# EAGLE schematic Relay-Board_Rack-PDU (EAGLE 9.2.1)

## Sheet 1 of 3
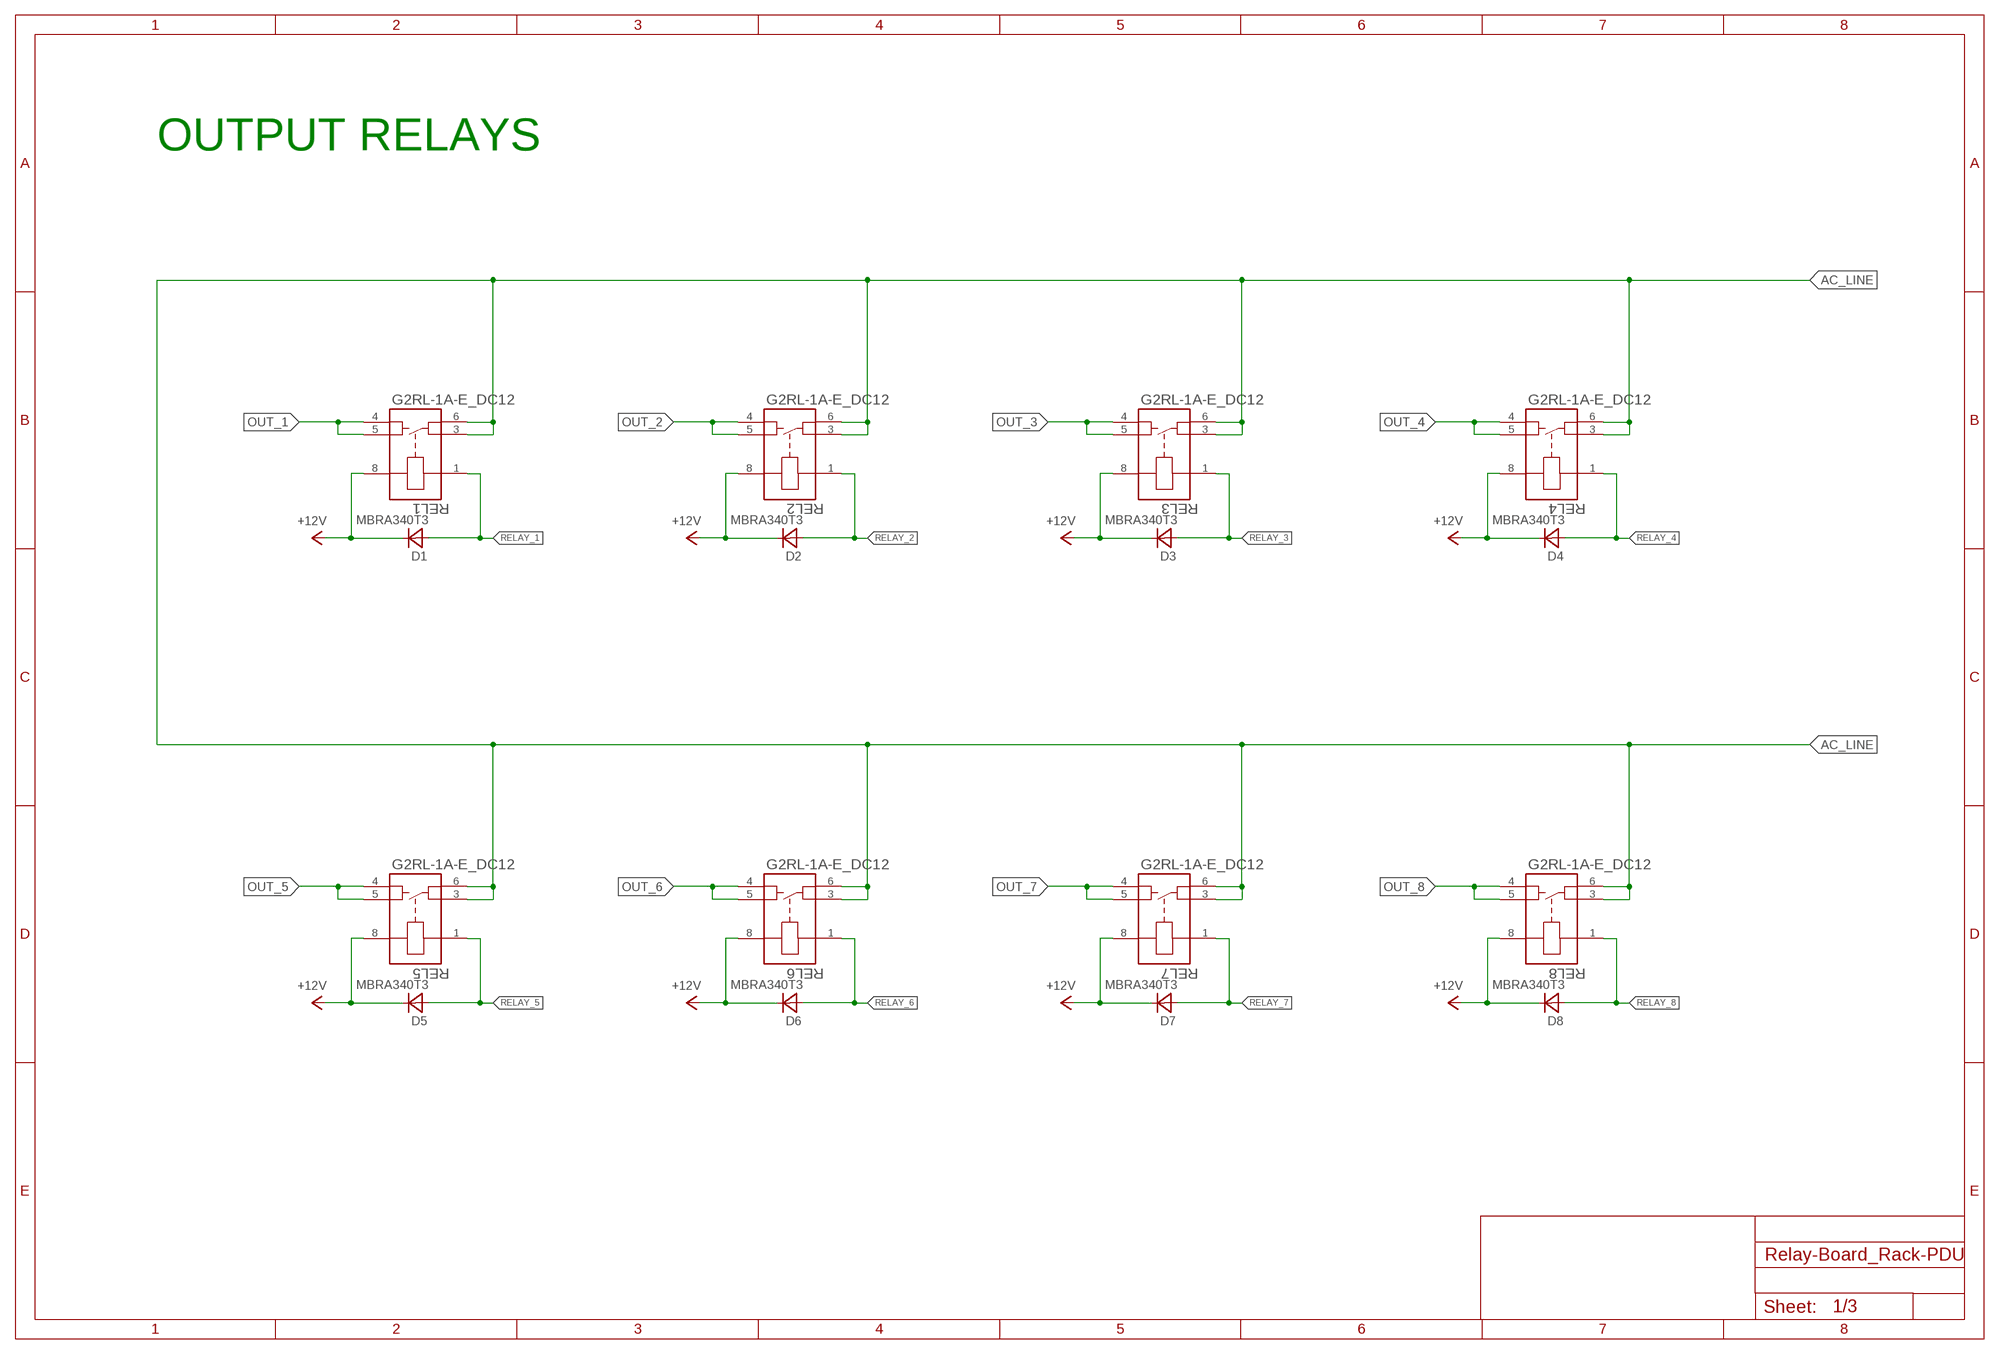
[diagram p0: schematic, sheet 1]

### Parts
D1  MBRA340T3  [SMA]
D2  MBRA340T3  [SMA]
D3  MBRA340T3  [SMA]
D4  MBRA340T3  [SMA]
D5  MBRA340T3  [SMA]
D6  MBRA340T3  [SMA]
D7  MBRA340T3  [SMA]
D8  MBRA340T3  [SMA]
REL1  G2RL-1A-E_DC12  [RELAY_G2RL-1A-E_DC5_OMR]
REL2  G2RL-1A-E_DC12  [RELAY_G2RL-1A-E_DC5_OMR]
REL3  G2RL-1A-E_DC12  [RELAY_G2RL-1A-E_DC5_OMR]
REL4  G2RL-1A-E_DC12  [RELAY_G2RL-1A-E_DC5_OMR]
REL5  G2RL-1A-E_DC12  [RELAY_G2RL-1A-E_DC5_OMR]
REL6  G2RL-1A-E_DC12  [RELAY_G2RL-1A-E_DC5_OMR]
REL7  G2RL-1A-E_DC12  [RELAY_G2RL-1A-E_DC5_OMR]
REL8  G2RL-1A-E_DC12  [RELAY_G2RL-1A-E_DC5_OMR]

### Nets
+12V: D1.C D2.C D3.C D4.C D5.C D6.C D7.C D8.C REL1.8 REL2.8 REL3.8 REL4.8 REL5.8 REL6.8 REL7.8 REL8.8
AC_LINE: REL1.3 REL1.6 REL2.3 REL2.6 REL3.3 REL3.6 REL4.3 REL4.6 REL5.3 REL5.6 REL6.3 REL6.6 REL7.3 REL7.6 REL8.3 REL8.6
OUT_1: REL1.4 REL1.5
OUT_2: REL2.4 REL2.5
OUT_3: REL3.4 REL3.5
OUT_4: REL4.4 REL4.5
OUT_5: REL5.4 REL5.5
OUT_6: REL6.4 REL6.5
OUT_7: REL7.4 REL7.5
OUT_8: REL8.4 REL8.5
RELAY_1: D1.A REL1.1
RELAY_2: D2.A REL2.1
RELAY_3: D3.A REL3.1
RELAY_4: D4.A REL4.1
RELAY_5: D5.A REL5.1
RELAY_6: D6.A REL6.1
RELAY_7: D7.A REL7.1
RELAY_8: D8.A REL8.1

### Notes on the sheet
- OUTPUT RELAYS

## Sheet 2 of 3
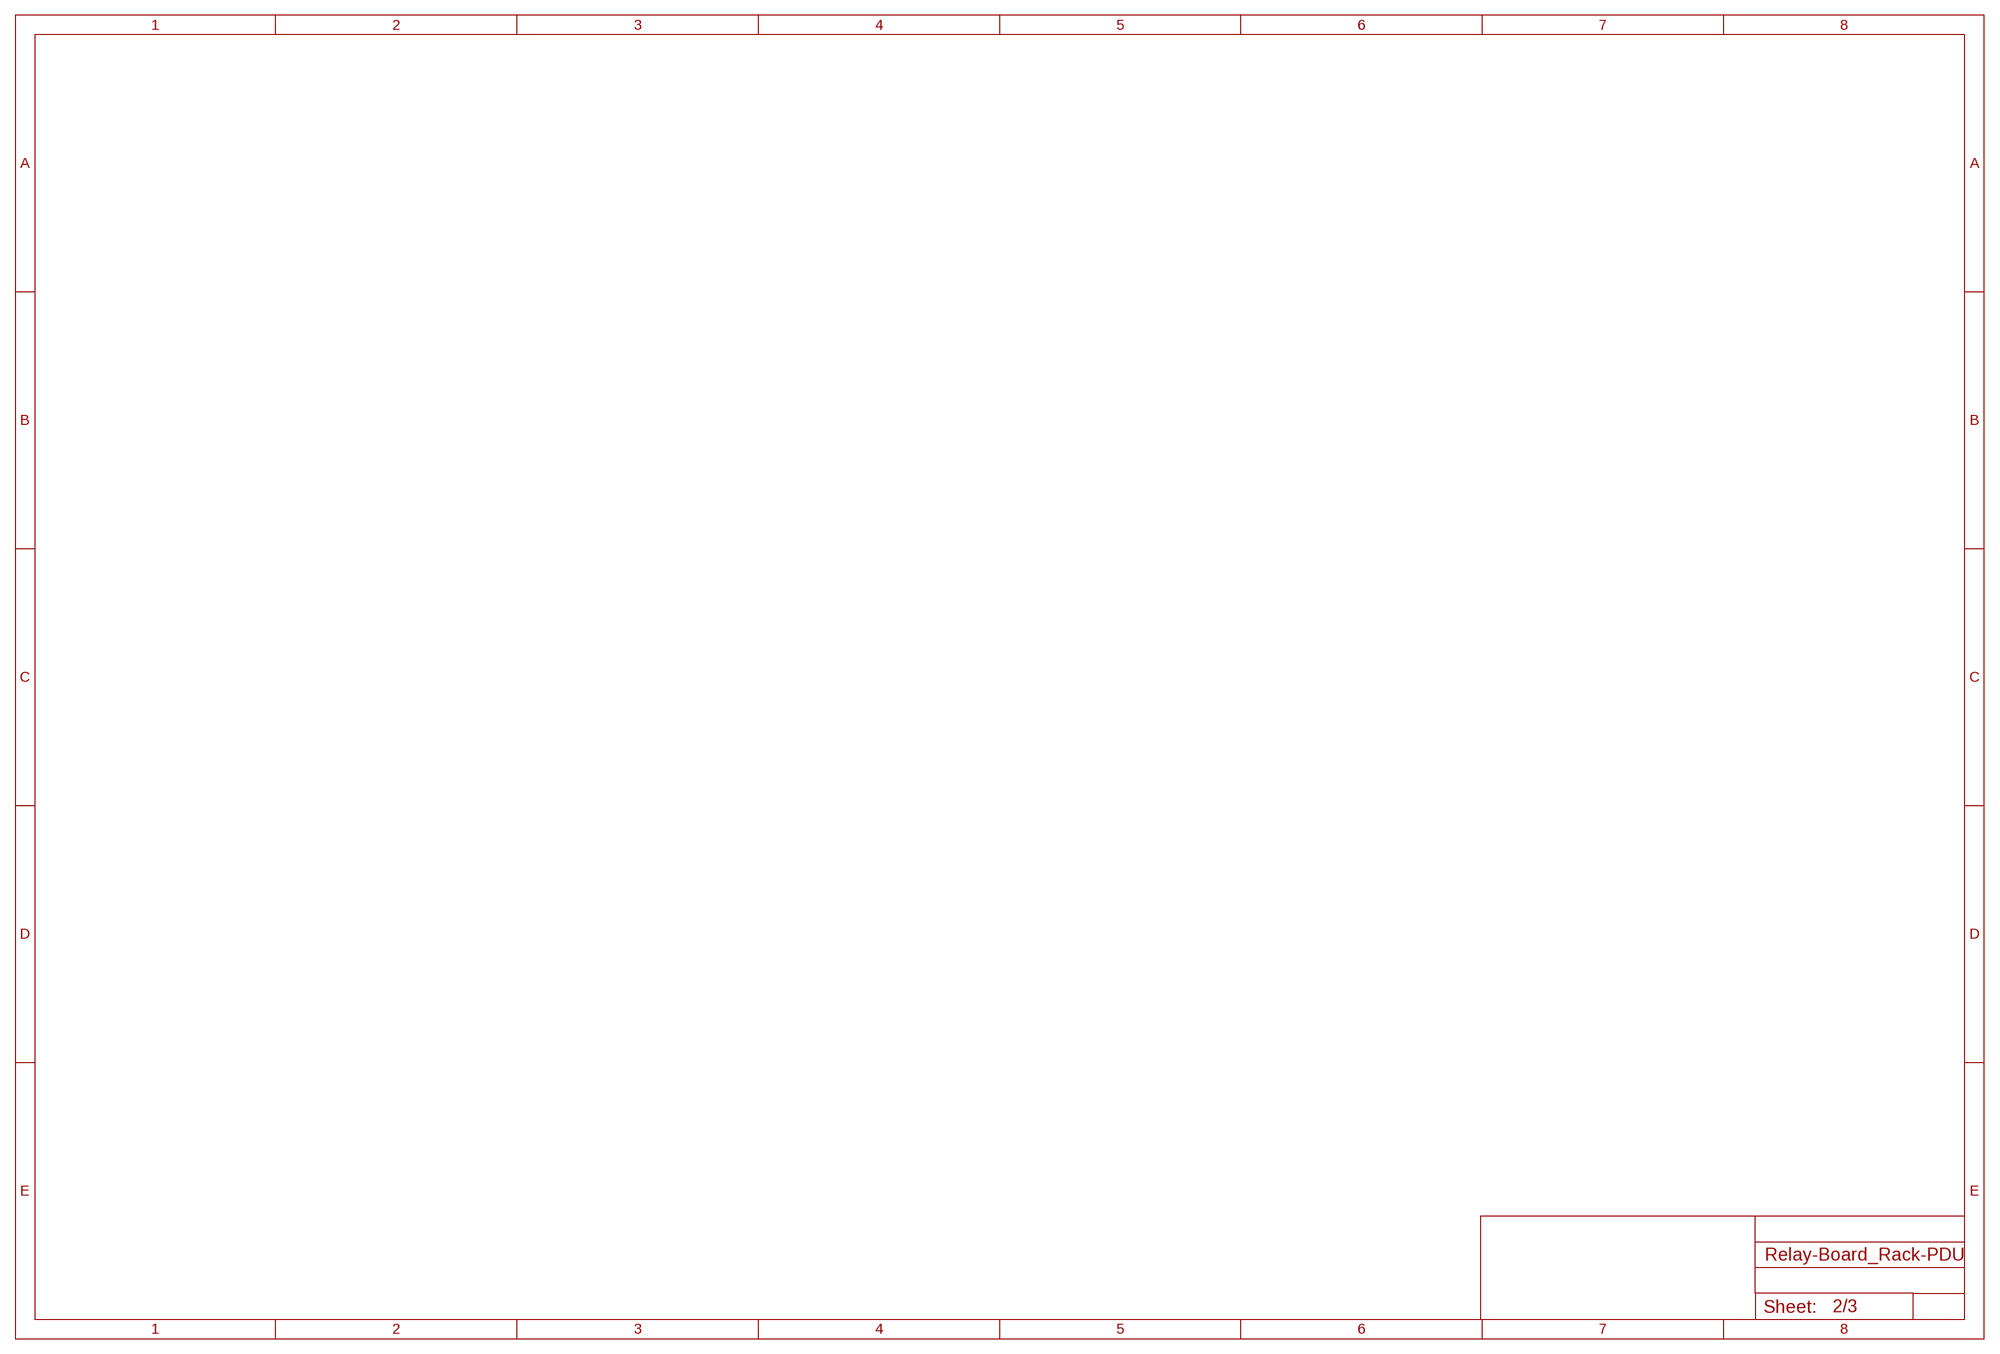
[diagram p1: schematic, sheet 2]

## Sheet 3 of 3
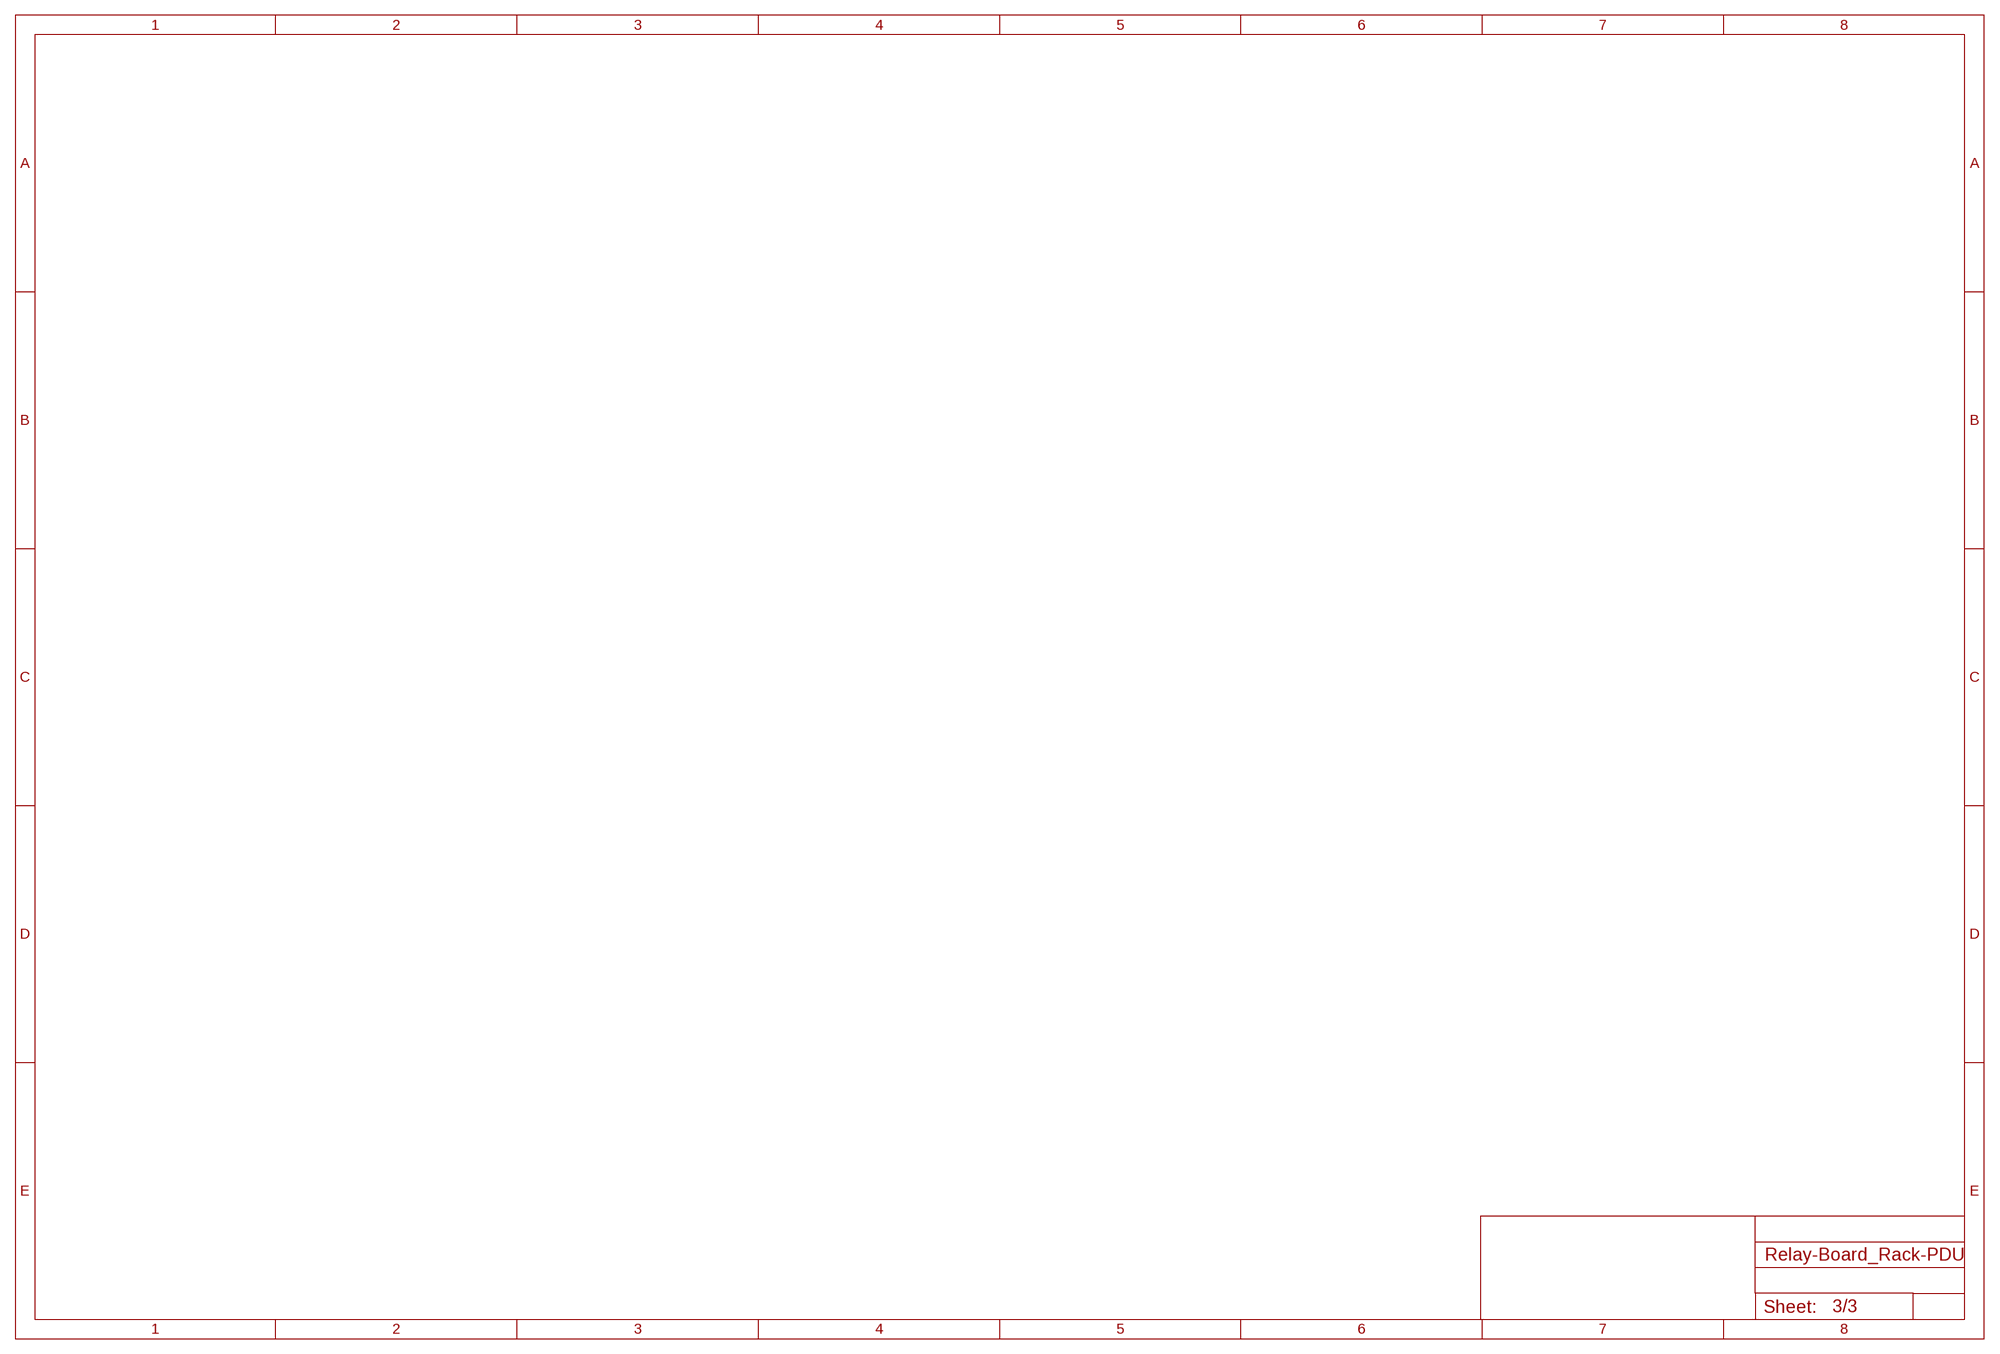
[diagram p2: schematic, sheet 3]

## Library data of the parts
D1-D8 = diode:MBRA340T3: Surface Mount Schottky Power Rectifier Source: http://www.onsemi.com/pub_link/Collateral/MBRA340T3-D.PDF
REL1-REL8 = ds_passive:G2RL-1A-E_DC12; COPYRIGHT: Copyright (C) 2025 Ultra Librarian. All rights reserved.; MANUFACTURER_PART_NUMBER: G2RL-1A-E DC12; MFR_NAME: Omron